# Altium schematic sheet fl_car (sch).SchDoc
size A
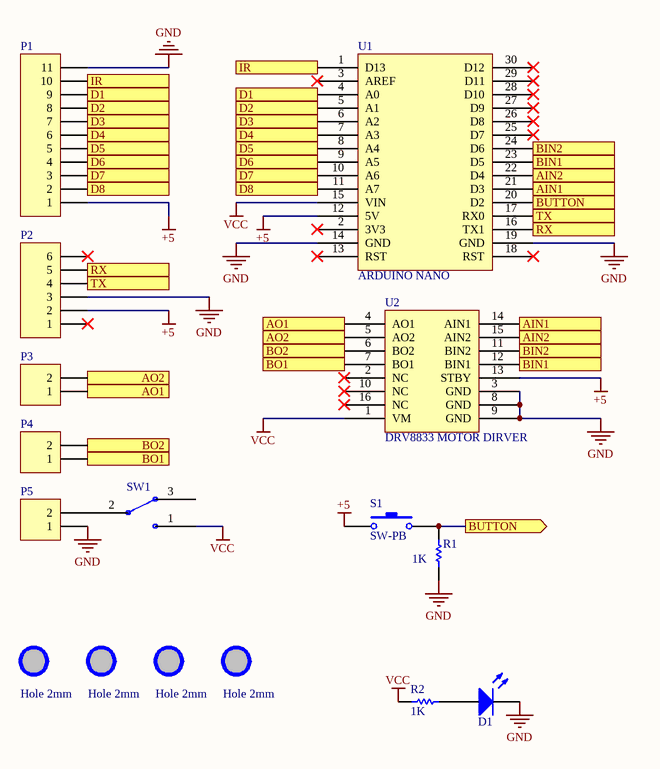
[diagram p0: fl_car (sch).SchDoc]

## Parts
*1  HOLE 2MM  [PCBComponent_1]  (value not drawn)
*2  HOLE 2MM  [PCBComponent_1]  (value not drawn)
*3  HOLE 2MM  [PCBComponent_1]  (value not drawn)
*4  HOLE 2MM  [PCBComponent_1]  (value not drawn)
D1  LED  [LED-3mm]  (value not drawn)
P1  Header 11  [HDR1X11]  (value not drawn)
P2  Header 6  [HDR1X6]  (value not drawn)
P3  Header 2  [HDR1X2]  (value not drawn)
P4  Header 2  [HDR1X2]  (value not drawn)
P5  Header 2  [HDR1X2]  (value not drawn)
R1  value 1K  [RES-SM-0805]  (hidden comment: RESISTOR SMD)
R2  value 1K  [RES-SM-0805]  (hidden comment: RESISTOR SMD)
S1  SW-PB  [SPST-2]
SW1  SW_SLIDE  [SW_SLIDE]  (value not drawn)
U1  ARDUINO NANO  [ARDUINO NANO]
U2  DRV8833 MOTOR DIRVER  [DRV8833 MOTOR DRIVER]

## Ports
AIN1 (in), AIN1 (out), AIN2 (in), AIN2 (out), AO1 (in), AO1 (out), AO2 (in), AO2 (out), BIN1 (in), BIN1 (out), BIN2 (in), BIN2 (out), BO1 (in), BO1 (out), BO2 (in), BO2 (out), BUTTON (in), BUTTON (out), D1 (in), D1 (out), D2 (in), D2 (out), D3 (in), D3 (out), D4 (in), D4 (out), D5 (in), D5 (out), D6 (in), D6 (out), D7 (in), D7 (out), D8 (in), D8 (out), IR (in), IR (out), RX (in), RX (out), TX (in), TX (out)

## Nets
+5: P1.1 P2.2 S1.1 U1.12(5V) U2.13(STBY)
GND: D1.2(K) P1.11 P2.3 P5.1 R1.2 U1.14(GND) U1.19(GND) U2.3(GND) U2.8(GND) U2.9(GND)
VCC: R2.1 SW1.1 U1.15(VIN) U2.1(VM)
AIN1: U1.21(D3) U2.14(AIN1) ; port AIN1
AIN2: U1.22(D4) U2.15(AIN2) ; port AIN2
AO1: P3.1 U2.4(AO1) ; port AO1
AO2: P3.2 U2.5(AO2) ; port AO2
BIN1: U1.23(D5) U2.12(BIN1) ; port BIN1
BIN2: U1.24(D6) U2.11(BIN2) ; port BIN2
BO1: P4.1 U2.7(BO1) ; port BO1
BO2: P4.2 U2.6(BO2) ; port BO2
BUTTON: R1.1 S1.2 U1.20(D2) ; port BUTTON
D1: P1.9 U1.4(A0) ; port D1
D2: P1.8 U1.5(A1) ; port D2
D3: P1.7 U1.6(A2) ; port D3
D4: P1.6 U1.7(A3) ; port D4
D5: P1.5 U1.8(A4) ; port D5
D6: P1.4 U1.9(A5) ; port D6
D7: P1.3 U1.10(A6) ; port D7
D8: P1.2 U1.11(A7) ; port D8
IR: P1.10 U1.1(D13) ; port IR
RX: P2.5 U1.16(TX1) ; port RX
TX: P2.4 U1.17(RX0) ; port TX
NetD1_1: D1.1(A) R2.2
NetP5_2: P5.2 SW1.2

Not connected (* = marked no-connect by the designer): P2 1* 6*; SW1 3; U1 2(3V3)* 3(AREF)* 13(RST)* 18(RST)* 25(D7)* 26(D8)* 27(D9)* 28(D10)* 29(D11)* 30(D12)*; U2 2(NC)* 10(NC)* 16(NC)*

## Notes on the sheet
- (in symbol HOLE 2MM) Hole 2mm

## Library data of the parts
P1 = Header 11: Header, 11-Pin; LatestRevisionDate: 17-Jul-2002; LatestRevisionNote: Re-released for DXP Platform.; Publisher: Altium Limited
P2 = Header 6: Header, 6-Pin; LatestRevisionDate: 17-Jul-2002; LatestRevisionNote: Re-released for DXP Platform.; Publisher: Altium Limited
P3-P5 = Header 2: Header, 2-Pin; LatestRevisionDate: 17-Jul-2002; LatestRevisionNote: Re-released for DXP Platform.; Publisher: Altium Limited
R1 R2 = RESISTOR SMD: Resistor
S1 = SW-PB: Switch; Published: 24-Mar-1999; LatestRevisionDate: 17-Jul-2002; LatestRevisionNote: Re-released for DXP Platform.; PackageReference: SPST-2; Publisher: Altium Limited; PackageDescription: Switch; 2 Leads